# EAGLE design RF1_12V (EAGLE 6.4)
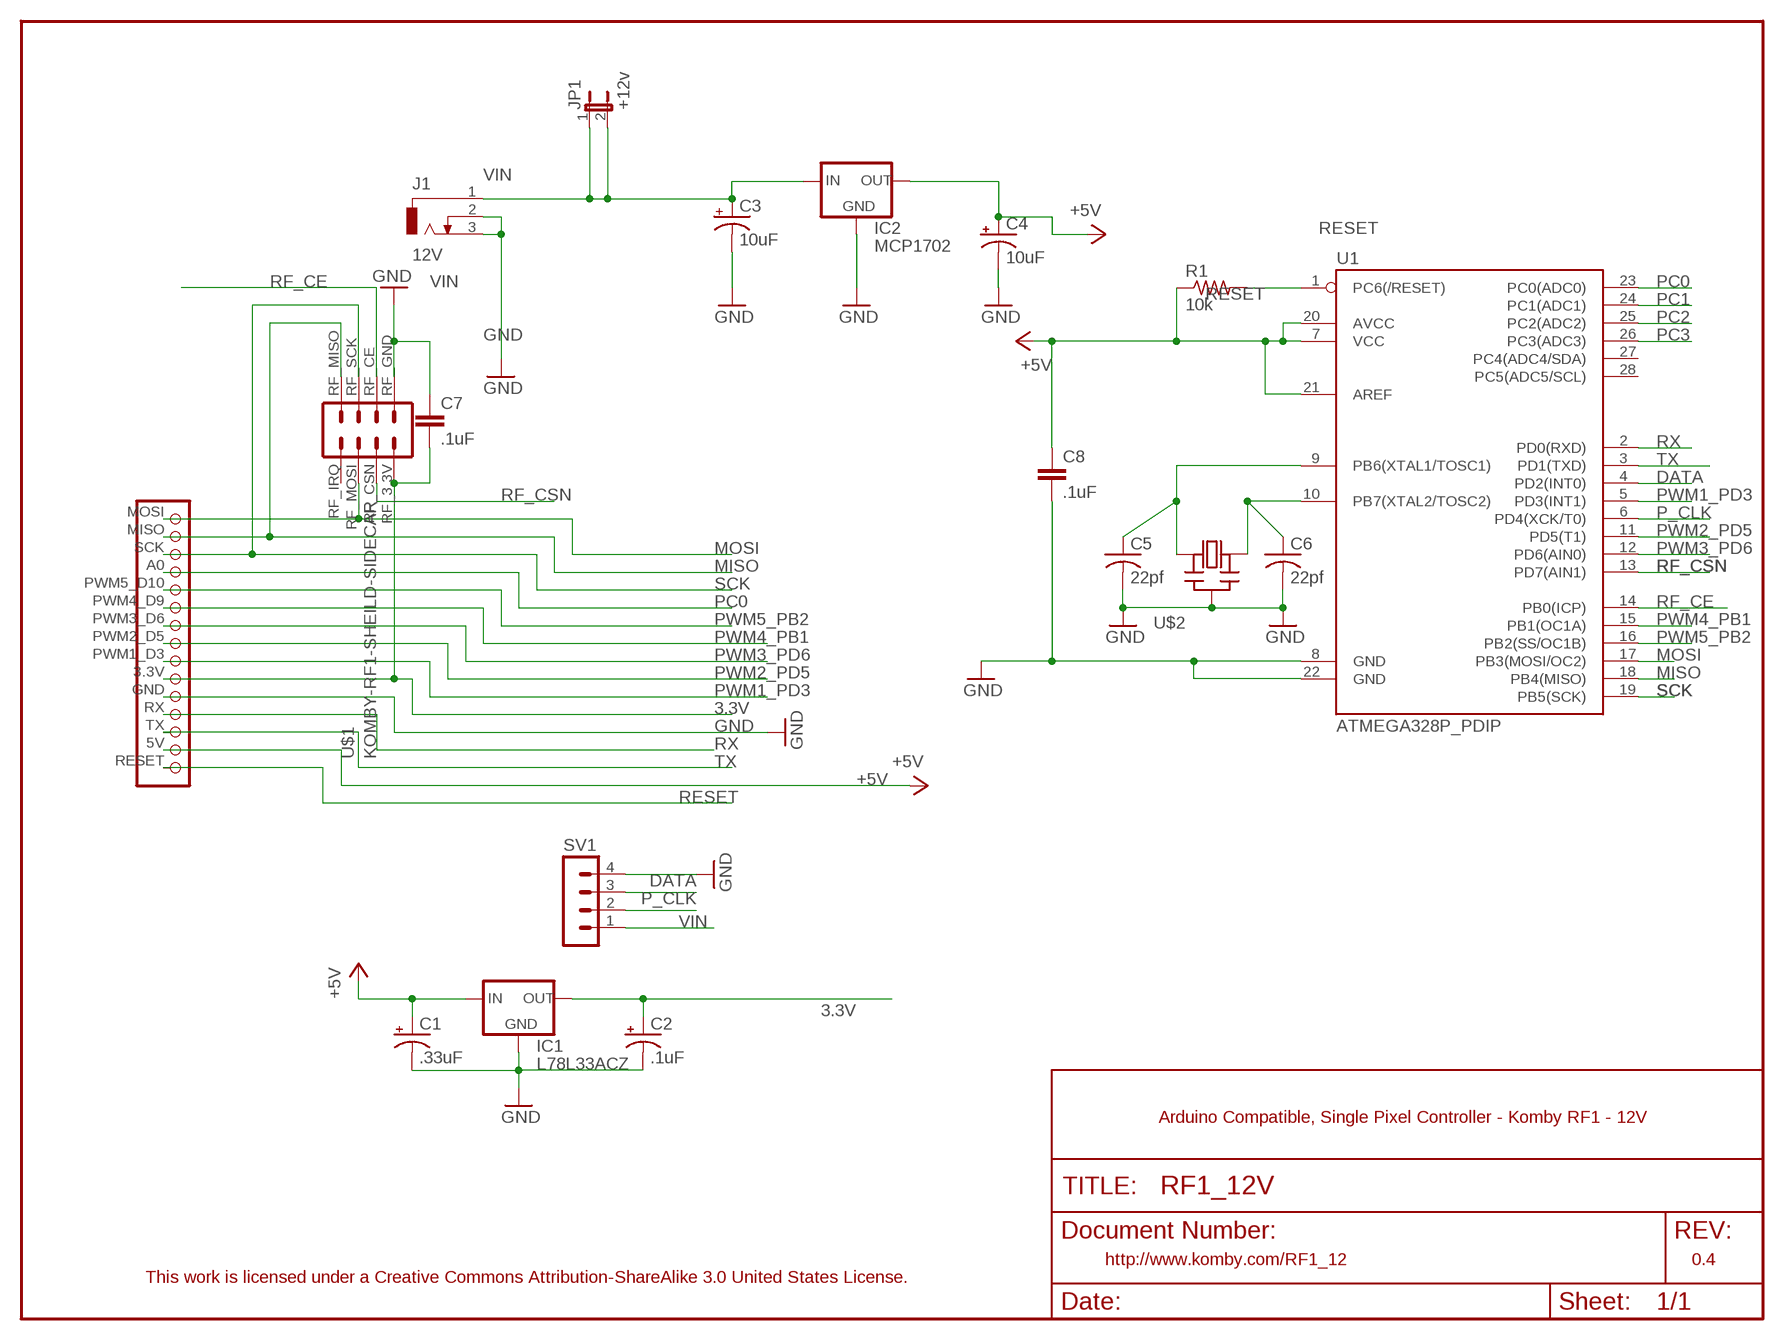
[diagram p0: schematic, sheet 1]

## Parts
C1  .33uF  CPOL-USE1.8-4  [E1,8-4]
C2  .1uF  CPOL-USE1.8-4  [E1,8-4]
C3  10uF  CPOL-USE1.8-4  [E1,8-4]
C4  10uF  CPOL-USE1.8-4  [E1,8-4]
C5  22pf  C-USC0805  [C0805]
C6  22pf  C-USC0805  [C0805]
C7  .1uF  C-EU025-024X044  [C025-024X044]
C8  .1uF  C-EU025-024X044  [C025-024X044]
IC1  L78L33ACZ  78LXX  [78LXX]
IC2  MCP1702  MCP1700TRI  [TO92]
J1  12V  DCJ0303  [DCJ0303]
JP1  +12v  JP1E  [JP1]
R1  10k  R-US_0207/7  [0207/7]
SV1  MA04-1  [MA04-1]
U1  ATMEGA328P_PDIP  [DIL28-3]
U$1  KOMBY-RF1-SHEILD-SIDECAR  [KOMBY-RF1-SIDECAR]
U$2  CERMOSCILL-THM  [CERM_OSC]

## Nets
3.3V: C2.+ C7.2 IC1.OUT U$1.3.3V U$1.RF_3.3V
+5V: C1.+ C4.+ C8.1 IC1.IN IC2.3(OUT) R1.1 U1.7(VCC) U1.20(AVCC) U1.21(AREF) U$1.5V
DATA: SV1.3 U1.4(PD2(INT0))
GND [vcc]: C1.- C2.- C3.- C4.- C5.2 C6.2 C7.1 C8.2 IC1.GND IC2.1(GND) J1.2 J1.3 SV1.4 U1.8(GND) U1.22(GND) U$1.GND U$1.RF_GND(RFGND_1) U$2.P$2(GND)
MISO: U1.18(PB4(MISO)) U$1.MISO U$1.RF_MISO
MOSI: U1.17(PB3(MOSI/OC2)) U$1.MOSI U$1.RF_MOSI
N$5: C6.1 U1.10(PB7(XTAL2/TOSC2)) U$2.P$3(OUT)
N$6: C5.1 U1.9(PB6(XTAL1/TOSC1)) U$2.P$1(IN)
P_CLK: SV1.2 U1.6(PD4(XCK/T0))
PC0: U1.23(PC0(ADC0)) U$1.A0(PC0)
PC1: U1.24(PC1(ADC1))
PC2: U1.25(PC2(ADC2))
PC3: U1.26(PC3(ADC3))
PWM1_PD3: U1.5(PD3(INT1)) U$1.PWM1_D3(PWM1)
PWM2_PD5: U1.11(PD5(T1)) U$1.PWM2_D5(PWM2)
PWM3_PD6: U1.12(PD6(AIN0)) U$1.PWM3_D6(PWM3)
PWM4_PB1: U1.15(PB1(OC1A)) U$1.PWM4_D9(PWM4)
PWM5_PB2: U1.16(PB2(SS/OC1B)) U$1.PWM5_D10(PWM5)
RESET: R1.2 U1.1(PC6(/RESET)) U$1.RESET
RF_CE: U1.14(PB0(ICP)) U$1.RF_CE
RF_CSN: U1.13(PD7(AIN1)) U$1.RF_CSN
RX: U1.2(PD0(RXD)) U$1.RX
SCK: U1.19(PB5(SCK)) U$1.RF_SCK U$1.SCK
TX: U1.3(PD1(TXD)) U$1.TX
VIN: C3.+ IC2.2(IN) J1.1 JP1.1 JP1.2 SV1.1
Unconnected: U1.27(PC4(ADC4/SDA)) U1.28(PC5(ADC5/SCL)) U$1.RF_IRQ

## Notes on the sheet
- Arduino Compatible, Single Pixel Controller - Komby RF1 - 12V
- http://www.komby.com/RF1_12 | 0.4
- This work is licensed under a Creative Commons Attribution-ShareAlike 3.0 United States License.

## Library data of the parts
C1-C4 = adafruit:CPOL-US: POLARIZED CAPACITOR, American symbol
C5 C6 = adafruit:C-US: CAPACITOR, American symbol
C7 C8 = resistor:C-EU: CAPACITOR, European symbol
IC1 = v-reg:78LXX: VOLTAGE REGULATOR
IC2 = adafruit:MCP1700: VOLTAGE REGULATOR
J1 = con-jack_komby:DCJ0303: DC POWER JACK Source: DCJ0303.pdf; OC_FARNELL: unknown; OC_NEWARK: unknown
JP1 = jumper:JP1E: JUMPER
R1 = adafruit:R-US_: RESISTOR, American symbol
SV1 = con-lstb:MA04-1: PIN HEADER; OC_FARNELL: unknown; OC_NEWARK: unknown
U1 = SparkFun-DigitalIC:ATMEGA328P_PDIP: uC used in the Arduino 32kb flash, 1k EEPROM, 2k SRAM This is the through-hole version of this chip.
U$1 = komby1:KOMBY-RF1-SHEILD-SIDECAR
U$2 = adafruit:CERMOSCILL: Ceramic oscillator with built in capacitors such as ZTT-12MHz http://www.ladyada.net/library/eagle

## Net classes
0 default: width 0.203 mm
1 vcc: width 0.305 mm

## Board
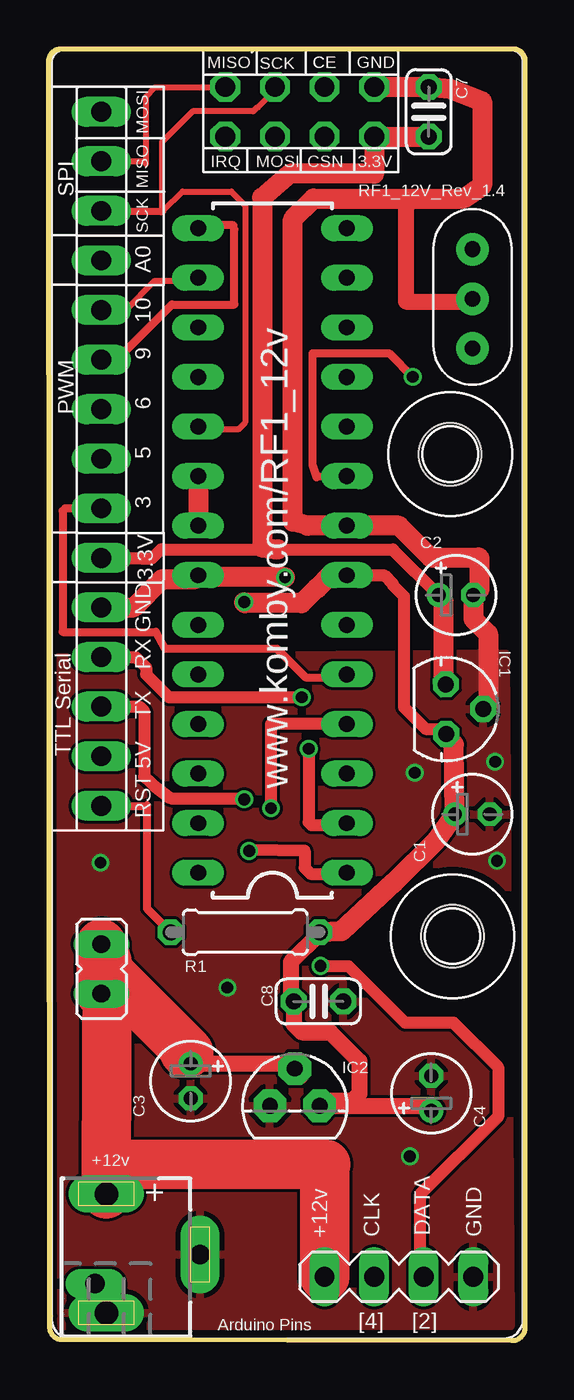
[diagram p1: board, top side]
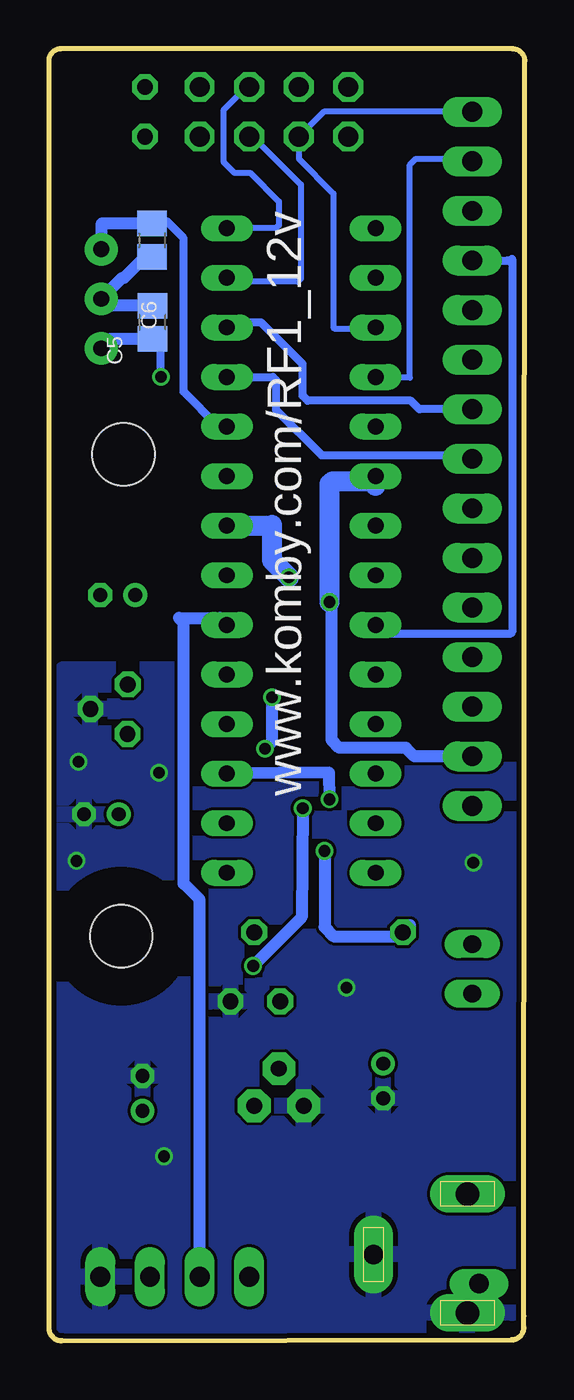
[diagram p2: board, bottom side, seen from below]

Size 24.38 x 66.19 mm. Coordinates in mm from the lower left corner, seen from the top.
Outline: 23.7,0 0.68,0.05 arc-90 0.05,0.68 0.05,1.27 0,65.56 arc-90 0.63,66.19 23.75,66.19 arc-90 24.38,65.61 24.38,0.63 arc-90 23.7,0
Copper layers (1*16): Top 0.035mm / dielectric 1.5mm / Bottom 0.035mm
Design rules "Fusion_eagle_rule_v1.1": minimum track width 6mil, minimum drill 12mil, track to track 6mil, track to pad 6mil, pad to pad 6mil, via to via 6mil, smd to smd 0mil, copper to edge 10mil, drill to drill 10mil, minimum pad ring 10mil, minimum via ring 6mil, stop-mask expansion 2mil, vias tented up to drill 100mil, thermal gap 10mil

### Footprints (pad centres in the part's own frame; a part is rotated, then mirrored left to right if it is on the bottom)
E1,8-4 = drill 0.711 pad 1.168: + -0.889,0 | drill 0.711 pad 1.168 octagon: - 0.889,0
C0805 = smd 1.3 x 1.5: 1 -0.85,0; 2 0.85,0
C025-024X044 = drill 0.813 octagon: 1 -1.27,0; 2 1.27,0
78LXX = drill 0.813 octagon: GND 0,1.905; IN 1.27,0; OUT -1.27,0
TO92 = drill 0.813 pad 1.676 octagon: 1 -1.27,0; 2 0,1.905; 3 1.27,0
DCJ0303 = drill 1.2 pad 1.93 long: 1 0,3.1; 3 0,-3 | drill 1 pad 2 long: 2 4.8,0 | drill 1 long: P$1 -0.589,-1.501
JP1 = drill 0.914 long: 1 0,-1.27; 2 0,1.27
0207/7 = drill 0.813 octagon: 1 -3.81,0; 2 3.81,0
MA04-1 = drill 1.016 long: 1 -3.81,0; 2 -1.27,0; 3 1.27,0; 4 3.81,0
DIL28-3 = drill 0.813 long: 1 -16.51,-3.81; 2 -13.97,-3.81; 3 -11.43,-3.81; 4 -8.89,-3.81; 5 -6.35,-3.81; 6 -3.81,-3.81; 7 -1.27,-3.81; 8 1.27,-3.81; 9 3.81,-3.81; 10 6.35,-3.81; 11 8.89,-3.81; 12 11.43,-3.81; 13 13.97,-3.81; 14 16.51,-3.81; 15 16.51,3.81; 16 13.97,3.81; 17 11.43,3.81; 18 8.89,3.81; 19 6.35,3.81; 20 3.81,3.81; 21 1.27,3.81; 22 -1.27,3.81; 23 -3.81,3.81; 24 -6.35,3.81; 25 -8.89,3.81; 26 -11.43,3.81; 27 -13.97,3.81; 28 -16.51,3.81
KOMBY-RF1-SIDECAR = drill 1.016 long: 3.3V 2.54,40.005; 5V 2.54,29.845; A0 2.54,55.245; GND 2.54,37.465; MISO 2.54,60.325; MOSI 2.54,62.865; PWM1_D3 2.54,42.545; PWM2_D5 2.54,45.085; PWM3_D6 2.54,47.625; PWM4_D9 2.54,50.165; PWM5_D10 2.54,52.705; RESET 2.54,27.305; RX 2.54,34.925; SCK 2.54,57.785; TX 2.54,32.385 | drill 1.016 octagon: RF_3.3V 16.51,61.595; RF_CE 13.97,64.135; RF_CSN 13.97,61.595; RF_GND 16.51,64.135; RF_IRQ 8.89,61.595; RF_MISO 8.89,64.135; RF_MOSI 11.43,61.595; RF_SCK 11.43,64.135 | hole 3.2: 20.406,45.323; 20.523,20.625
CERM_OSC = drill 0.813 pad 1.676: P$1 -2.54,0; P$2 0,0; P$3 2.54,0

### Placement (x,y rotation side)
C1  21.69,26.97 0 top
C2  20.85,38.2 0 top
C3  7.26,13.31 270 top
C4  19.58,12.67 90 top
C5  19.07,52.17 90 bottom
C6  19.1,56.39 270 bottom
C7  19.46,62.97 270 top
C8  13.81,17.38 0 top
IC1  20.34,32.36 270.3 top
IC2  12.6,12.04 0 top
J1  2.95,4.42 0 top
JP1  2.69,19.05 0 top
R1  10.06,20.93 180 top
SV1  17.93,3.28 0 top
U1  11.45,40.49 90 top
U$1  0.15,0.1 0 top
U$2  21.7,53.38 90 top

### Tracks (layer width: path | path; a pad name or v marks a point on that pad's centre or on a via)
3.3V
  Top 0.61: U$1.3.3V 4.7,40.11 4.72,40.08 5.28,40.08 5.74,40.54 11.73,40.54 17.63,40.54 C2.+ 20.22,37.9 | IC1.OUT 20.34,33.7 20.22,33.93
  Top 1.016: 20.22,33.93 20.22,37.9 | C7.2 U$1.RF_3.3V 16.66,59.79 12.34,59.79 10.92,58.57 10.92,40.64 11.73,40.54
+5V  (via drill 0.6)
  Top 0.61: U1.7 17.17,39.22 17.63,38.76 17.63,38.71 18.19,38.15 18.19,32.46 19.3,31.34 20.1,31.34 IC1.IN
  Top 0.813: R1.1 13.87,20.88 12.39,19.4 12.39,17.53 C8.1 12.54,16.21 12.95,15.8 14.43,15.8 15.9,14.32 15.9,12.65 15.54,12.29 14.12,12.29 IC2.3 19.33,12.04 C4.+
  Top 1.016: U1.20 U1.21 | U1.7 14.43,39.22 13.77,38.56 13.72,38.56 12.95,37.79 10.06,37.79 v10.01,37.84 | IC1.IN 20.75,30.52 C1.+ 19.84,25.63 17.68,23.47 14.99,20.98 R1.1
  Bottom 0.61: U$1.5V 5.66,29.95 6.1,30.38 9.5,30.38 9.91,30.78 9.91,37.74 v10.01,37.84 | U1.20 7.64,43.86 7.68,43.83
  Bottom 1.016: v10.01,37.84 10.01,43.89 9.85,44.04 7.9,44.04 7.68,43.83 7.64,43.79
DATA  (via drill 0.6)
  Top 0.61: U1.4 11.38,31.6 v11.38,27.28 | v13.92,19.2 15.34,19.2 18.24,16.31 20.73,16.31 23.01,14.02 23.01,11.48 19,7.47 19,3.48 SV1.3
  Bottom 0.61: v11.38,27.28 11.43,21.69 v13.92,19.2
GND  (via drill 0.6)
  Top 0.61: 22.5,32.62 IC1.GND | U1.8 17.93,41.76 | 22,40.13 22.05,40.08 | 22.05,38.51 C2.-
  Top 0.813: 18.92,58.52 arc90 18.29,57.89 18.29,53.24 21.25,53.24 arc90 U$2.P$2
  Top 1.016: C2.- 21.74,36.98 22.5,36.22 22.5,32.62 | 22,40.13 19.56,40.13 17.93,41.76 13.26,41.76 12.5,41.96 12.5,57.45 13.56,58.52 18.92,58.52 21.23,58.52 22.2,59.18 22.2,63.5 20.55,64.13 C7.1 U$1.RF_GND | 22.05,40.08 22.05,38.51 | v12.09,39.11 7.75,39.11 U1.22 7.44,39.01 5.79,39.01 4.34,37.57 U$1.GND
  Bottom 0.61: C5.2 21.34,53.02 U$2.P$2 20.62,54.46 20.52,54.46 19.44,55.54 C6.2
  Bottom 1.016: U1.8 13,41.76 12.95,41.81 12.95,39.98 v12.09,39.11
  other vias: 22.96,24.59 18.74,29.11 22.86,29.67 9.14,18.08 2.64,24.48 18.49,9.45
  pour Bottom: 0.79,0.74 0.79,35.03 16.66,34.39 23.65,34.39 23.65,0.74
  pour Top: 0.28,0.74 0.28,35.03 23.39,35.23 23.65,0.74
MISO
  Top 0.305: U$1.MISO 4.85,60.43 4.98,60.3 4.98,63.75 5.43,64.21 9.02,64.21 U$1.RF_MISO
  Bottom 0.305: U1.18 5.94,49.38 5.89,49.33 5.89,60.25 5.59,60.55 2.82,60.55 U$1.MISO
MOSI
  Bottom 0.305: U$1.MOSI 10.31,62.97 U$1.RF_MOSI 11.58,60.55 9.8,58.77 9.8,51.92 9.75,51.87 7.7,51.87 U1.17
N$5
  Bottom 0.406: U1.10 15.7,46.84 17.47,48.61 17.47,56.49 18.34,57.35 18.98,57.35 C6.1
  Bottom 0.61: C6.1 21.65,57.24 21.69,57.2 U$2.P$3
N$6  (via drill 0.6)
  Top 0.406: U1.9 13.72,44.25 13.51,44.86 13.51,50.6 17.42,50.6 v18.64,49.38
  Bottom 0.406: v18.64,49.38 18.64,50.89 C5.1
  Bottom 0.61: C5.1 21.22,51.32 U$2.P$1
P_CLK
  Bottom 0.61: SV1.2 16.66,22.6 17.47,23.42 17.47,36.78 17.73,37.03 15.62,37.03 U1.6
PC0
  Bottom 0.406: U$1.A0 0.89,55.35 0.86,55.32 0.76,55.32 0.66,55.42 0.66,36.32 0.76,36.22 7.19,36.22 U1.23
PWM1_PD3
  Top 0.406: U$1.PWM1_D3 0.84,42.65 0.71,42.52 0.71,36.32 5.49,36.32 5.94,35.46 11.68,35.46 13.16,33.98 15.11,33.98 U1.5
PWM2_PD5
  Bottom 0.406: U1.11 12.9,49.38 12.75,49.22 12.75,47.7 10.41,45.36 2.87,45.36 U$1.PWM2_D5
PWM3_PD6
  Bottom 0.406: U$1.PWM3_D6 5.41,47.73 5.84,48.16 11.12,48.16 11.38,48.41 11.38,50.04 13.51,52.17 15.01,52.17 U1.12
PWM4_PB1
  Top 0.406: U$1.PWM4_D9 3.48,50.27 6.3,53.08 9.5,53.08 9.5,56.95 9.45,57.15 7.8,57.15 U1.15
PWM5_PB2
  Top 0.305: U$1.PWM5_D10 3.94,52.81 5.43,54.3 7.49,54.3 U1.16
RESET  (via drill 0.6)
  Top 0.406: U$1.RESET 5,27.41 5.03,27.43 5.03,22.15 R1.2
  Top 0.61: v10.26,25.09 10.31,25.14 13.11,25.09 13.11,24.23 13.41,23.93 15.21,23.93 U1.1
  Bottom 0.61: v10.26,25.09 10.26,21.18 9.8,20.73 6.45,20.73 R1.2 5.89,21.28
RF_CE
  Bottom 0.305: U$1.RF_CE 14.25,64.24 15.44,63.04 15.44,60.4 14.88,59.84 14.07,59.84 12.6,58.37 12.6,57.15 12.75,57 U1.14
RF_CSN
  Bottom 0.305: U$1.RF_CSN 13.94,61.7 11.48,59.23 11.48,54.41 11.63,54.25 15.06,54.25 U1.13
RX  (via drill 0.6)
  Top 0.61: U$1.RX 4.44,35.03 4.98,34.49 4.98,34.14 6.15,32.97 v12.95,32.97 | v13.31,30.33 13.31,26.57 13.46,26.41 15.16,26.41 U1.2
  Bottom 0.61: v12.95,32.97 12.95,30.68 v13.31,30.33
SCK
  Top 0.305: U$1.RF_SCK 11.58,64.06 10.72,63.19 10.67,63.19 10.46,62.99 7.37,62.99 5.79,61.42 5.79,57.86 5.74,57.81 2.77,57.81 U$1.SCK 5.87,57.89 6.86,58.88 9.35,58.88 10.06,58.16 10.06,47.04 9.7,46.68 7.8,46.68 U1.19
TX  (via drill 0.6)
  Top 0.61: U$1.TX 4.65,32.49 4.88,32.26 4.88,28.9 5.23,28.6 5.38,28.45 6.25,27.79 9.75,27.79 v10.01,27.74
  Bottom 0.61: v10.01,27.74 10.03,29.11 U1.3
VIN
  Top 0.61: C3.+ 7.26,14.68 6.81,15.14
  Top 0.813: C3.+ 12.27,14.2 12.9,13.56 12.9,13.64 IC2.2
  Top 2.54: J1.1 2.95,8.58 | 2.95,8.58 3,19.35 JP1.2 JP1.1 2.79,19.15 6.81,15.14 7.16,14.78 6.96,14.78 | SV1.1 14.12,8.99 14.17,9.04 3.4,9.04 2.95,8.58

### Text on the board
tNames: RF1_12V_Rev_1.4 | www.komby.com/RF1_12v | +12v | +12v | CLK | DATA | GND | [4] | [2] | Arduino Pins
bNames: www.komby.com/RF1_12v